# Altium project EasyPay.PrjPcb
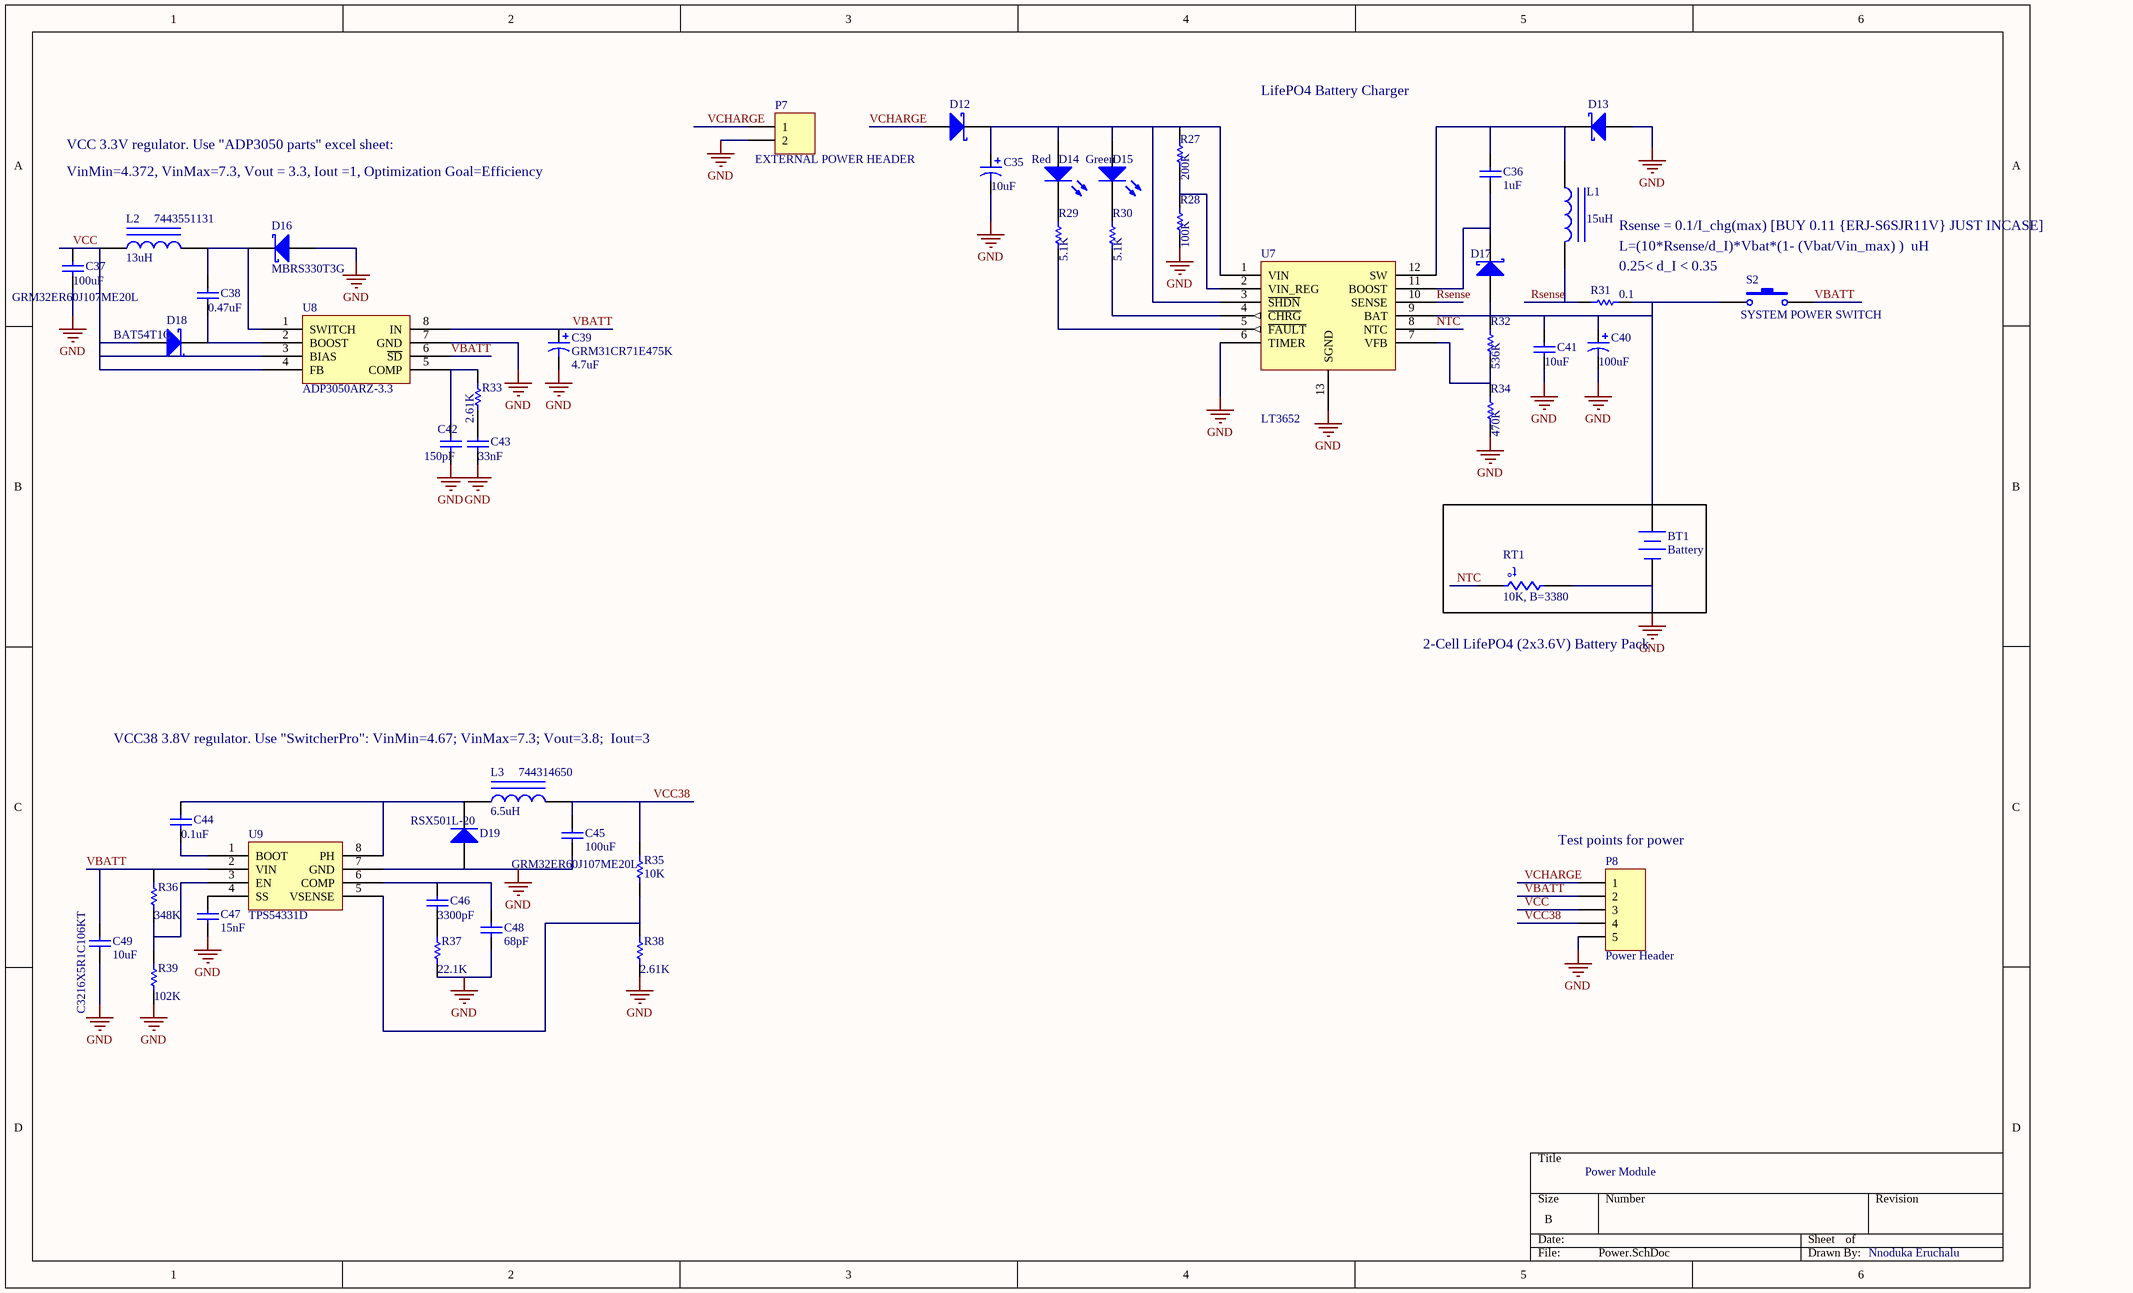
[diagram p0: Power.SchDoc]
4 sheets, 127 parts. Net scope: global (net labels, ports and power ports of the same name join across sheets).
Board file: EasyPay.PcbDoc
Sheets:
  Power.SchDoc
  Data.SchDoc
  MCU.SchDoc
  Peripherals.SchDoc

## Sheet Power.SchDoc
size B

### Parts
BT1  Battery  [JST PH]
C35  value 10uF  [TC7343-2917]  (hidden comment: TR3D106K035C0125)
C36  value 1uF  [2012[0805]]  (hidden comment: C2012Y5V1H105Z/0.85)
C37  GRM32ER60J107ME20L  value 100uF  [3225[1210]]
C38  value 0.47uF  [2012[0805]]  (hidden comment: CGJ4J2X7R0J474K)
C39  GRM31CR71E475K  value 4.7uF  [3216[1206]]
C40  value 100uF  [TC7343-2917]  (hidden comment: T495D107K010ZTE100)
C41  value 10uF  [2012[0805]]  (hidden comment: GRM21BR71A106KE51L)
C42  value 150pF  [2012[0805]]  (hidden comment: C0805C151J5GACTU)
C43  value 33nF  [2012[0805]]  (hidden comment: C0805C333J3RACTU)
C44  value 0.1uF  [2012[0805]]  (hidden comment: C2012X7R1H104K/0.85)
C45  GRM32ER60J107ME20L  value 100uF  [3225[1210]]
C46  value 3300pF  [2012[0805]]  (hidden comment: C2012C0G1H332J/1.25)
C47  value 15nF  [2012[0805]]  (hidden comment: C2012C0G1H153J)
C48  value 68pF  [2012[0805]]  (hidden comment: C0805C680J5GACTU)
C49  C3216X5R1C106KT  value 10uF  [3216[1206]]
D12  CDBA340L-G  [SMA DO-214AC]  (value not drawn)
D13  CDBA340L-G  [SMA DO-214AC]  (value not drawn)
D14  value Red  [LTST-C17X]  (hidden comment: LTST-C170KRKT)
D15  value Green  [LTST-C17X]  (hidden comment: LTST-C171GKT)
D16  MBRS330T3G  [SMC DO-214AB]
D17  CDBA340L-G  [SMA DO-214AC]  (value not drawn)
D18  BAT54T1G  [SOD123]
D19  RSX501L-20  [RSX501L-20]
L1  value 15uH  [SLF7055]  (hidden comment: SLF7055T-150M2R1-3PF)
L2  7443551131  value 13uH  [7443551131]
L3  744314650  value 6.5uH  [744314650]
P7  EXTERNAL POWER HEADER  [JST PH]
P8  Power Header  [HDR1X5]
R27  value 200K  [2012[0805]]  (hidden comment: ERJ-6GEYJ204V)
R28  value 100K  [2012[0805]]  (hidden comment: ERJ-6GEYJ104V)
R29  value 5.1K  [2012[0805]]  (hidden comment: ERJ-6GEYJ512V)
R30  value 5.1K  [2012[0805]]  (hidden comment: ERJ-6GEYJ512V)
R31  value 0.1  [2012[0805]]  (hidden comment: ERJ-L06KF10CV)
R32  value 536K  [2012[0805]]  (hidden comment: ERJ-6ENF5363V)
R33  value 2.61K  [2012[0805]]  (hidden comment: ERJ-6ENF2611V)
R34  value 470K  [2012[0805]]  (hidden comment: ERJ-6GEYJ474V)
R35  value 10K  [2012[0805]]  (hidden comment: ERJ-6ENF1002V)
R36  value 348K  [2012[0805]]  (hidden comment: ERJ-6ENF3483V)
R37  value 22.1K  [2012[0805]]  (hidden comment: ERJ-6ENF2212V)
R38  value 2.61K  [2012[0805]]  (hidden comment: ERJ-6ENF2611V)
R39  value 102K  [2012[0805]]  (hidden comment: ERJ-6ENF1023V)
RT1  value 10K, B=3380  [1608[0603]]  (hidden comment: NCP18XH103F03RB)
S2  SYSTEM POWER SWITCH  [JST PH]
U7  LT3652  [LT3652MSE]
U8  ADP3050ARZ-3.3  [SOIC127P600-8N]
U9  TPS54331D  [SOIC127P600-8N]

### Nets
GND: BT1.2(-) C35.2 C37.1 C39.2 C40.2 C41.1 C42.1 C43.1 C45.1 C47.1 C48.1 C49.1 D13.1(A) D16.1(A) D19.1(A) P7.2 P8.5 R28.2 R34.2 R37.2 R38.2 R39.2 RT1.2 U7.6(TIMER) U7.13(SGND) U8.7(GND) U9.7(GND)
VCC: C37.2 D18.1(A) L2.1 P8.3 U8.3(BIAS) U8.4(FB)
VCC38: C45.2 L3.2 P8.4 R35.1
NTC: RT1.1 U7.8(NTC)
Rsense: L1.2 R31.2 U7.10(SENSE)
VBATT: C39.1 C49.2 P8.2 R36.1 S2.2 U8.6(~{SD}) U8.8(IN) U9.2(VIN)
VCHARGE: D12.1(A) P7.1 P8.1
NetBT1_1: BT1.1(+) C40.1 C41.2 D17.1(A) R31.1 R32.1 S2.1 U7.9(BAT)
NetC35_1: C35.1 D12.2(K) D14.1(A) D15.1(A) R27.1 U7.1(VIN) U7.3(~{SHDN})
NetC36_1: C36.1 D17.2(K) U7.11(BOOST)
NetC36_2: C36.2 D13.2(K) L1.1 U7.12(SW)
NetC38_1: C38.1 D18.2(K) U8.2(BOOST)
NetC38_2: C38.2 D16.2(K) L2.2 U8.1(SWITCH)
NetC42_2: C42.2 R33.1 U8.5(COMP)
NetC43_2: C43.2 R33.2
NetC44_1: C44.1 U9.1(BOOT)
NetC44_2: C44.2 D19.2(K) L3.1 U9.8(PH)
NetC46_1: C46.1 R37.1
NetC46_2: C46.2 C48.2 U9.6(COMP)
NetC47_2: C47.2 U9.4(SS)
NetD14_2: D14.2(K) R29.1
NetD15_2: D15.2(K) R30.1
NetR27_2: R27.2 R28.1 U7.2(VIN_REG)
NetR29_2: R29.2 U7.5(~{FAULT})
NetR30_2: R30.2 U7.4(~{CHRG})
NetR32_2: R32.2 R34.1 U7.7(VFB)
NetR35_2: R35.2 R38.1 U9.5(VSENSE)
NetR36_2: R36.2 R39.1 U9.3(EN)

### Notes on the sheet
- LifePO4 Battery Charger
- VCC 3.3V regulator. Use "ADP3050 parts" excel sheet:
- VinMin=4.372, VinMax=7.3, Vout = 3.3, Iout =1, Optimization Goal=Efficiency
- Rsense = 0.1/I_chg(max) [BUY 0.11 {ERJ-S6SJR11V} JUST INCASE]
- L=(10*Rsense/d_I)*Vbat*(1- (Vbat/Vin_max) )  uH
- 0.25< d_I < 0.35
- 2-Cell LifePO4 (2x3.6V) Battery Pack
- VCC38 3.8V regulator. Use "SwitcherPro": VinMin=4.67; VinMax=7.3; Vout=3.8;  Iout=3
- (near P8) Test points for power
- Power Module
- Nnoduka Eruchalu
- (in symbol Res Thermal) t°

### Library data of the parts
BT1 = Battery: Multicell Battery; Published: 24-Mar-1999; LatestRevisionDate: 17-Jul-2002; LatestRevisionNote: Re-released for DXP Platform.; PackageReference: BAT-2; Publisher: Altium Limited
C35 C39 C40 = Cap Pol1: Polarized Capacitor (Radial); Published: 8-Jun-2000; LatestRevisionDate: 17-Jul-2002; LatestRevisionNote: Re-released for DXP Platform.; PackageReference: RB7.6-15; Publisher: Altium Limited
C36-C38 C41-C49 = C0805: Ceramic Chip Capacitor - Standard; Note: Footprint corresponds to dimensions for bulk cassette packaging. This case size has tightened tolerances.; Published: 17-Jul-2002; LatestRevisionDate: 19-Mar-2004; LatestRevisionNote: Silkscreen size reduced.; DatasheetDocument: Mar-2001; PackageDocument: Mar-2001; PackageReference: 0805; Publisher: Altium Limited; Code_JEITA: 0805; Code_IPC: 2012[0805]; ComponentLink1Description: Manufacturer Link; ComponentLink1URL: http://www.kemet.com/; ComponentLink2Description: Datasheet; ComponentLink2URL: http://www.kemet.com/kemet/web/homepage/kechome.nsf/vapubfilesname/F3102TA.pdf/$file/F3102TA.pdf
D12 D13 D16 D17 = 30BQ040: Schottky Rectifier; Published: 8-Jun-2000; LatestRevisionDate: 17-Jul-2002; LatestRevisionNote: Re-released for DXP Platform.; DatasheetDocument: PD-2.439; PackageReference: SMC; Publisher: Altium Limited; Code_JEDEC: DO-214-AB; ComponentLink1Description: Manufacturer Link; ComponentLink1URL: http://www.irf.com/; ComponentLink2Description: Datasheet; ComponentLink2URL: http://www.irf.com/product-info/datasheets/data/30bq040.pdf
D14 D15 = LED2: Typical RED, GREEN, YELLOW, AMBER GaAs LED; Published: 8-Jun-2000; LatestRevisionDate: 17-Jul-2002; LatestRevisionNote: Re-released for DXP Platform.; PackageDocument: Feb-2002; PackageReference: 3.2X1.6X1.1; Publisher: Altium Limited
D18 = Diode 11DQ03: Schottky Rectifier; Published: 8-Jun-2000; LatestRevisionDate: 17-Jul-2002; LatestRevisionNote: Re-released for DXP Platform.; DatasheetDocument: Dec-1997; PackageReference: DO-204AL; Publisher: Altium Limited; Code_JEDEC: DO-204-AL; ComponentLink1Description: Manufacturer Link; ComponentLink1URL: http://www.irf.com/; ComponentLink2Description: Datasheet; ComponentLink2URL: http://www.irf.com/product-info/datasheets/data/11dq03.pdf
D19 = Diode: Default Diode; Published: 8-Jun-2000; LatestRevisionDate: 17-Jul-2002; LatestRevisionNote: Re-released for DXP Platform.; PackageDocument: Sep-1996; PackageReference: SMC; Publisher: Altium Limited; Code_JEDEC: DO-214-AB
L1-L3 = Inductor Iron: Magnetic-Core Inductor; Published: 24-Mar-1999; LatestRevisionDate: 17-Jul-2002; LatestRevisionNote: Re-released for DXP Platform.; PackageReference: AXIAL-0.9; Publisher: Altium Limited
P7 = Header 2: Header, 2-Pin; LatestRevisionDate: 17-Jul-2002; LatestRevisionNote: Re-released for DXP Platform.; Publisher: Altium Limited
P8 = Header 5: Header, 5-Pin; LatestRevisionDate: 17-Jul-2002; LatestRevisionNote: Re-released for DXP Platform.; Publisher: Altium Limited
R27-R39 = Res1: Resistor; Published: 8-Jun-2000; LatestRevisionDate: 17-Jul-2002; LatestRevisionNote: Re-released for DXP Platform.; PackageReference: AXIAL-0.3; Publisher: Altium Limited
RT1 = Res Thermal: Thermistor; Published: 24-Mar-1999; LatestRevisionDate: 04-Mar-2005; LatestRevisionNote: PCB Footprint replaced.; PackageReference: 6-0805; Publisher: Altium Limited
S2 = SW-PB: Switch; Published: 24-Mar-1999; LatestRevisionDate: 17-Jul-2002; LatestRevisionNote: Re-released for DXP Platform.; PackageReference: SPST-2; Publisher: Altium Limited

## Sheet Data.SchDoc
size B
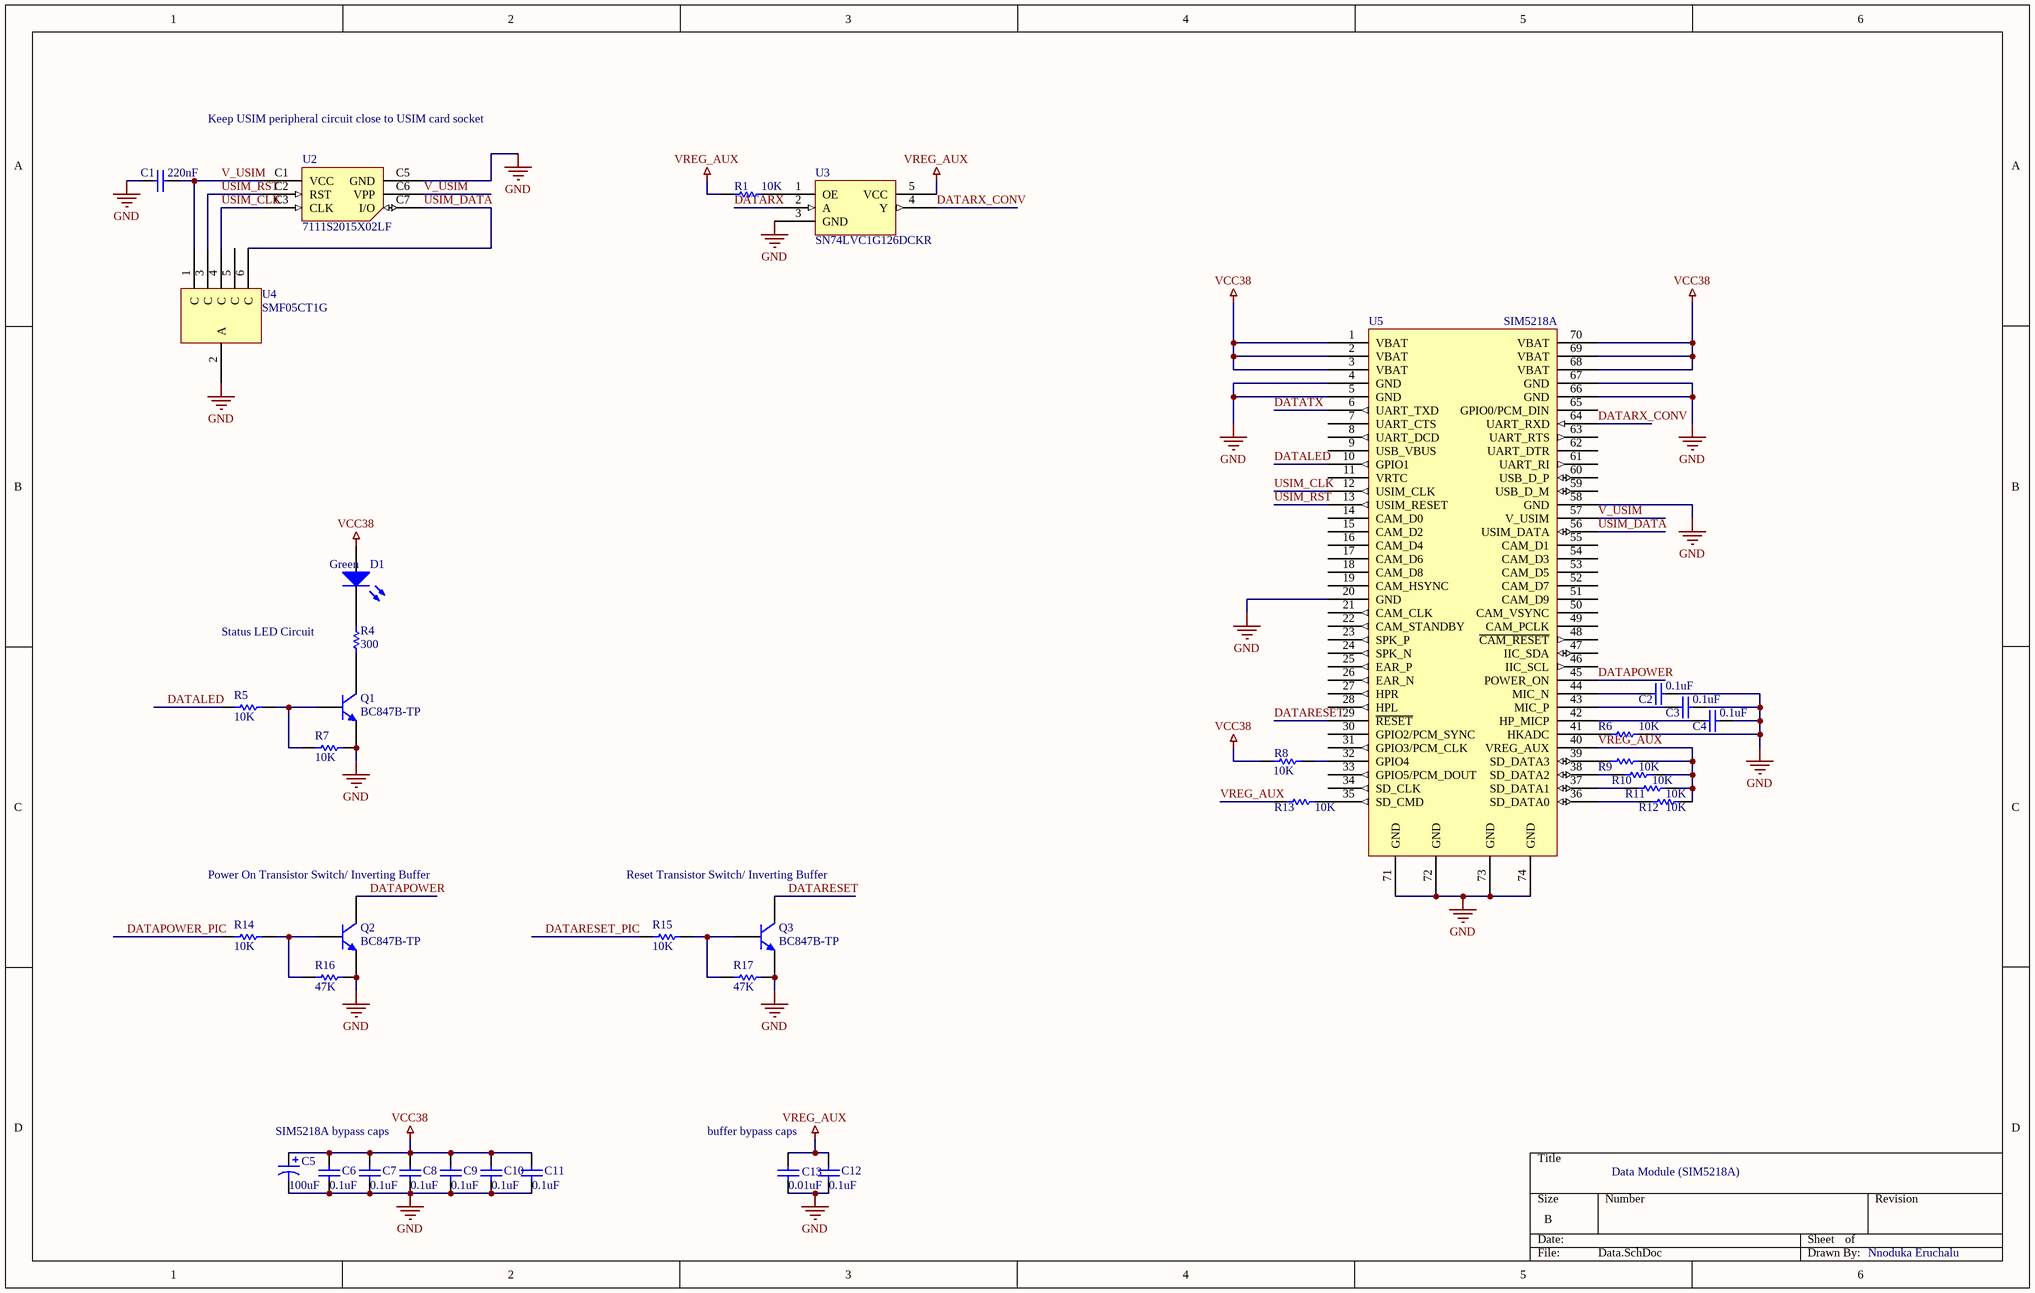
[diagram p1: Data.SchDoc]

### Parts
C1  value 220nF  [2012[0805]]  (hidden comment: C2012X7R1H224K)
C2  value 0.1uF  [2012[0805]]  (hidden comment: C2012X7R1H104K/0.85)
C3  value 0.1uF  [2012[0805]]  (hidden comment: C2012X7R1H104K/0.85)
C4  value 0.1uF  [2012[0805]]  (hidden comment: C2012X7R1H104K/0.85)
C5  value 100uF  [TC3528-1411]  (hidden comment: T520B107M004ATE070)
C6  value 0.1uF  [2012[0805]]  (hidden comment: C2012X7R1H104K/0.85)
C7  value 0.1uF  [2012[0805]]  (hidden comment: C2012X7R1H104K/0.85)
C8  value 0.1uF  [2012[0805]]  (hidden comment: C2012X7R1H104K/0.85)
C9  value 0.1uF  [2012[0805]]  (hidden comment: C2012X7R1H104K/0.85)
C10  value 0.1uF  [2012[0805]]  (hidden comment: C2012X7R1H104K/0.85)
C11  value 0.1uF  [2012[0805]]  (hidden comment: C2012X7R1H104K/0.85)
C12  value 0.1uF  [2012[0805]]  (hidden comment: C2012X7R1H104K/0.85)
C13  value 0.01uF  [2012[0805]]  (hidden comment: C2012X7R2E103K)
D1  value Green  [LTST-C17X]  (hidden comment: LTST-C171GKT)
Q1  BC847B-TP  [SOT23-3N]
Q2  BC847B-TP  [SOT23-3N]
Q3  BC847B-TP  [SOT23-3N]
R1  value 10K  [2012[0805]]  (hidden comment: ERJ-6GEYJ103V)
R4  value 300  [2012[0805]]  (hidden comment: ERJ-6GEYJ301V)
R5  value 10K  [2012[0805]]  (hidden comment: ERJ-6GEYJ103V)
R6  value 10K  [2012[0805]]  (hidden comment: ERJ-6GEYJ103V)
R7  value 10K  [2012[0805]]  (hidden comment: ERJ-6GEYJ103V)
R8  value 10K  [2012[0805]]  (hidden comment: ERJ-6GEYJ103V)
R9  value 10K  [2012[0805]]  (hidden comment: ERJ-6GEYJ103V)
R10  value 10K  [2012[0805]]  (hidden comment: ERJ-6GEYJ103V)
R11  value 10K  [2012[0805]]  (hidden comment: ERJ-6GEYJ103V)
R12  value 10K  [2012[0805]]  (hidden comment: ERJ-6GEYJ103V)
R13  value 10K  [2012[0805]]  (hidden comment: ERJ-6GEYJ103V)
R14  value 10K  [2012[0805]]  (hidden comment: ERJ-6GEYJ103V)
R15  value 10K  [2012[0805]]  (hidden comment: ERJ-6GEYJ103V)
R16  value 47K  [2012[0805]]  (hidden comment: ERJ-6GEYJ473V)
R17  value 47K  [2012[0805]]  (hidden comment: ERJ-6GEYJ473V)
U2  7111S2015X02LF  [7111S2015X02LF]
U3  SN74LVC1G126DCKR  [SOT353-5N]
U4  SMF05CT1G  [SOT363-6N]
U5  SIM5218A  [SIM5218A v2]

### Nets
GND: C1.1 C2.2 C3.2 C4.2 C5.2 C6.1 C7.1 C8.1 C9.1 C10.1 C11.1 C12.1 C13.1 Q1.2(E) Q2.2(E) Q3.2(E) R6.2 R7.1 R16.1 R17.1 U2.C5(GND) U3.3(GND) U4.2(A) U5.4(GND) U5.5(GND) U5.20(GND) U5.58(GND) U5.66(GND) U5.67(GND) U5.71(GND) U5.72(GND) U5.73(GND) U5.74(GND)
VCC38: C5.1 C6.2 C7.2 C8.2 C9.2 C10.2 C11.2 D1.1(A) R8.1 U5.1(VBAT) U5.2(VBAT) U5.3(VBAT) U5.68(VBAT) U5.69(VBAT) U5.70(VBAT)
VREG_AUX: C12.2 C13.2 R1.2 R9.2 R10.2 R11.2 R12.2 R13.1 U3.5(VCC) U5.40(VREG_AUX)
DATALED: R5.2 U5.10(GPIO1)
DATAPOWER: Q2.3(C) U5.45(POWER_ON)
DATAPOWER_PIC: R14.2
DATARESET: Q3.3(C) U5.29(~{RESET})
DATARESET_PIC: R15.2
DATARX: U3.2(A)
DATARX_CONV: U3.4(Y) U5.64(UART_RXD)
DATATX: U5.6(UART_TXD)
USIM_CLK: U2.C3(CLK) U4.4(C) U5.12(USIM_CLK)
USIM_DATA: U2.C7(I/O) U4.6(C) U5.56(USIM_DATA)
USIM_RST: U2.C2(RST) U4.3(C) U5.13(USIM_RESET)
V_USIM: C1.2 U2.C1(VCC) U2.C6(VPP) U4.1(C) U5.57(V_USIM)
NetC2_1: C2.1 U5.44(MIC_N)
NetC3_1: C3.1 U5.43(MIC_P)
NetC4_1: C4.1 U5.42(HP_MICP)
NetD1_2: D1.2(K) R4.1
NetQ1_1: Q1.1(B) R5.1 R7.2
NetQ1_3: Q1.3(C) R4.2
NetQ2_1: Q2.1(B) R14.1 R16.2
NetQ3_1: Q3.1(B) R15.1 R17.2
NetR1_1: R1.1 U3.1(OE)
NetR6_1: R6.1 U5.41(HKADC)
NetR8_2: R8.2 U5.32(GPIO4)
NetR9_1: R9.1 U5.39(SD_DATA3)
NetR10_1: R10.1 U5.38(SD_DATA2)
NetR11_1: R11.1 U5.37(SD_DATA1)
NetR12_1: R12.1 U5.36(SD_DATA0)
NetR13_2: R13.2 U5.35(SD_CMD)

Not connected (* = marked no-connect by the designer): U4 5(C); U5 7(UART_CTS) 8(UART_DCD) 9(USB_VBUS) 11(VRTC) 14(CAM_D0) 15(CAM_D2) 16(CAM_D4) 17(CAM_D6) 18(CAM_D8) 19(CAM_HSYNC) 21(CAM_CLK) 22(CAM_STANDBY) 23(SPK_P) 24(SPK_N) 25(EAR_P) 26(EAR_N) 27(HPR) 28(HPL) 30(GPIO2/PCM_SYNC) 31(GPIO3/PCM_CLK) 33(GPIO5/PCM_DOUT) 34(SD_CLK) 46(IIC_SCL) 47(IIC_SDA) 48(~{CAM_RESET}) 49(CAM_PCLK) 50(CAM_VSYNC) 51(CAM_D9) 52(CAM_D7) 53(CAM_D5) 54(CAM_D3) 55(CAM_D1) 59(USB_D_M) 60(USB_D_P) 61(UART_RI) 62(UART_DTR) 63(UART_RTS) 65(GPIO0/PCM_DIN)

### Notes on the sheet
- Keep USIM peripheral circuit close to USIM card socket
- (near R4) Status LED Circuit
- Power On Transistor Switch/ Inverting Buffer
- Reset Transistor Switch/ Inverting Buffer
- SIM5218A bypass caps
- buffer bypass caps
- Data Module (SIM5218A)
- Nnoduka Eruchalu

### Library data of the parts
C1-C4 C6-C13 = C0805: as C36 on sheet Power; Published: 17-Jul-2002; LatestRevisionDate: 19-Mar-2004; LatestRevisionNote: Silkscreen size reduced.; DatasheetDocument: Mar-2001; PackageDocument: Mar-2001; PackageReference: 0805; Publisher: Altium Limited; Code_JEITA: 0805; Code_IPC: 2012[0805]; ComponentLink1Description: Manufacturer Link; ComponentLink1URL: http://www.kemet.com/; ComponentLink2Description: Datasheet; ComponentLink2URL: http://www.kemet.com/kemet/web/homepage/kechome.nsf/vapubfilesname/F3102TA.pdf/$file/F3102TA.pdf
C5 = Cap Pol1: Polarized Capacitor (Radial); Published: 8-Jun-2000; LatestRevisionDate: 17-Jul-2002; LatestRevisionNote: Re-released for DXP Platform.; PackageReference: RB7.6-15; Publisher: Altium Limited
D1 = LED2: as D14 on sheet Power; Published: 8-Jun-2000; LatestRevisionDate: 17-Jul-2002; LatestRevisionNote: Re-released for DXP Platform.; PackageDocument: Feb-2002; PackageReference: 3.2X1.6X1.1; Publisher: Altium Limited
Q1-Q3 = NPN: NPN Bipolar Transistor; Published: 8-Jun-2000; LatestRevisionDate: 17-Jul-2002; LatestRevisionNote: Re-released for DXP Platform.; PackageReference: TO-226; Publisher: Altium Limited; Code_JEDEC: TO-226-AA
R1 R4-R17 = Res1: Resistor; Published: 8-Jun-2000; LatestRevisionDate: 17-Jul-2002; LatestRevisionNote: Re-released for DXP Platform.; PackageReference: AXIAL-0.3; Publisher: Altium Limited
U3 = SN74LVC1G126
U4 = SMF05C

## Sheet MCU.SchDoc
size B
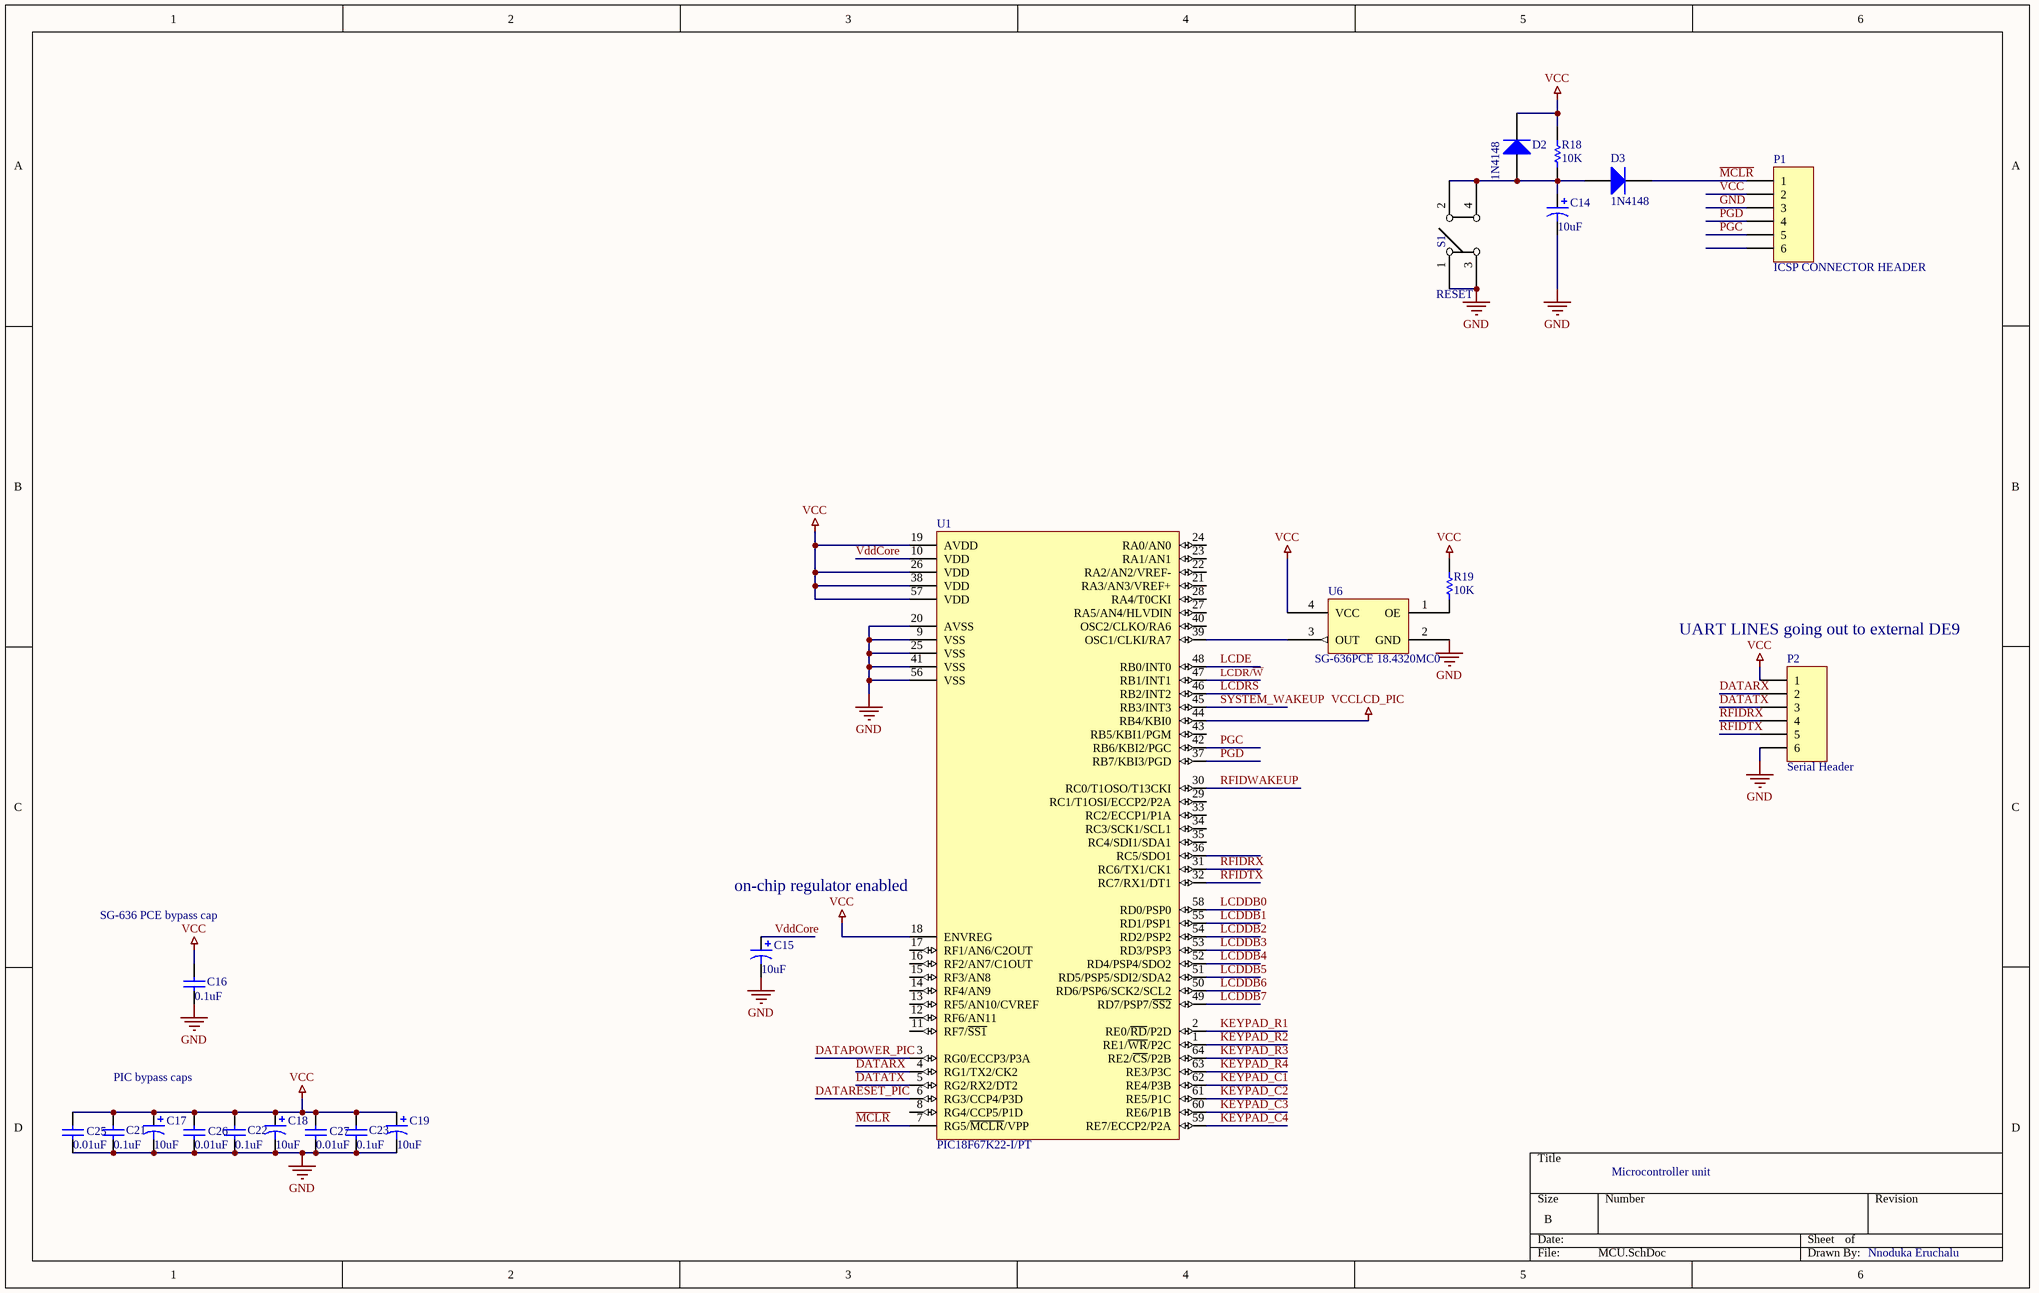
[diagram p2: MCU.SchDoc]

### Parts
C14  value 10uF  [3216[1206]]  (hidden comment: T520A106M010ATE080)
C15  value 10uF  [3216[1206]]  (hidden comment: T520A106M010ATE080)
C16  value 0.1uF  [2012[0805]]  (hidden comment: C2012X7R1H104K/0.85)
C17  value 10uF  [3216[1206]]  (hidden comment: T520A106M010ATE080)
C18  value 10uF  [3216[1206]]  (hidden comment: T520A106M010ATE080)
C19  value 10uF  [3216[1206]]  (hidden comment: T520A106M010ATE080)
C21  value 0.1uF  [2012[0805]]  (hidden comment: C2012X7R1H104K/0.85)
C22  value 0.1uF  [2012[0805]]  (hidden comment: C2012X7R1H104K/0.85)
C23  value 0.1uF  [2012[0805]]  (hidden comment: C2012X7R1H104K/0.85)
C25  value 0.01uF  [2012[0805]]  (hidden comment: C2012X7R2E103K)
C26  value 0.01uF  [2012[0805]]  (hidden comment: C2012X7R2E103K)
C27  value 0.01uF  [2012[0805]]  (hidden comment: C2012X7R2E103K)
D2  1N4148  [SOD123]
D3  1N4148  [SOD123]
P1  ICSP CONNECTOR HEADER  [HDR1X6]
P2  Serial Header  [HDR1X6]
R18  value 10K  [2012[0805]]  (hidden comment: ERJ-6GEYJ103V)
R19  value 10K  [2012[0805]]  (hidden comment: ERJ-6GEYJ103V)
S1  value RESET  [D6C]  (hidden comment: D6C00 F2 LFS)
U1  PIC18F67K22-I/PT  [TQFP-PT64_N]
U6  SG-636PCE 18.4320MC0  [SG-636PCE]

### Nets
GND: C14.2 C15.2 C16.1 C17.2 C18.2 C19.2 C21.1 C22.1 C23.1 C25.1 C26.1 C27.1 P1.3 P2.6 S1.1 S1.3 U1.9(VSS) U1.20(AVSS) U1.25(VSS) U1.41(VSS) U1.56(VSS) U6.2(GND)
VCC: C16.2 C17.1 C18.1 C19.1 C21.2 C22.2 C23.2 C25.2 C26.2 C27.2 D2.2(K) P1.2 P2.1 R18.1 R19.1 U1.18(ENVREG) U1.19(AVDD) U1.26(VDD) U1.38(VDD) U1.57(VDD) U6.4(VCC)
VCCLCD_PIC: U1.44(RB4/KBI0)
DATAPOWER_PIC: U1.3(RG0/ECCP3/P3A)
DATARESET_PIC: U1.6(RG3/CCP4/P3D)
DATARX: P2.2 U1.4(RG1/TX2/CK2)
DATATX: P2.3 U1.5(RG2/RX2/DT2)
KEYPAD_C1: U1.62(RE4/P3B)
KEYPAD_C2: U1.61(RE5/P1C)
KEYPAD_C3: U1.60(RE6/P1B)
KEYPAD_C4: U1.59(RE7/ECCP2/P2A)
KEYPAD_R1: U1.2(RE0/~{RD}/P2D)
KEYPAD_R2: U1.1(RE1/~{WR}/P2C)
KEYPAD_R3: U1.64(RE2/~{CS}/P2B)
KEYPAD_R4: U1.63(RE3/P3C)
LCDDB0: U1.58(RD0/PSP0)
LCDDB1: U1.55(RD1/PSP1)
LCDDB2: U1.54(RD2/PSP2)
LCDDB3: U1.53(RD3/PSP3)
LCDDB4: U1.52(RD4/PSP4/SDO2)
LCDDB5: U1.51(RD5/PSP5/SDI2/SDA2)
LCDDB6: U1.50(RD6/PSP6/SCK2/SCL2)
LCDDB7: U1.49(RD7/PSP7/~{SS2})
LCDE: U1.48(RB0/INT0)
LCDR/~{W}: U1.47(RB1/INT1)
LCDRS: U1.46(RB2/INT2)
~{MCLR}: D3.2(K) P1.1 U1.7(RG5/~{MCLR}/VPP)
PGC: P1.5 U1.42(RB6/KBI2/PGC)
PGD: P1.4 U1.37(RB7/KBI3/PGD)
RFIDRX: P2.4 U1.31(RC6/TX1/CK1)
RFIDTX: P2.5 U1.32(RC7/RX1/DT1)
RFIDWAKEUP: U1.30(RC0/T1OSO/T13CKI)
SYSTEM_WAKEUP: U1.45(RB3/INT3)
VddCore: C15.1 U1.10(VDD)
NetC14_1: C14.1 D2.1(A) D3.1(A) R18.2 S1.2 S1.4
NetR19_2: R19.2 U6.1(OE)
NetU1_39: U1.39(OSC1/CLKI/RA7) U6.3(OUT)

Not connected (* = marked no-connect by the designer): P1 6; U1 8(RG4/CCP5/P1D) 11(RF7/~{SS1}) 12(RF6/AN11) 13(RF5/AN10/CVREF) 14(RF4/AN9) 15(RF3/AN8) 16(RF2/AN7/C1OUT) 17(RF1/AN6/C2OUT) 21(RA3/AN3/VREF+) 22(RA2/AN2/VREF-) 23(RA1/AN1) 24(RA0/AN0) 27(RA5/AN4/HLVDIN) 28(RA4/T0CKI) 29(RC1/T1OSI/ECCP2/P2A) 33(RC2/ECCP1/P1A) 34(RC3/SCK1/SCL1) 35(RC4/SDI1/SDA1) 36(RC5/SDO1) 40(OSC2/CLKO/RA6) 43(RB5/KBI1/PGM)

### Notes on the sheet
- (near P2) UART LINES going out to external DE9
- (near U1) on-chip regulator enabled
- SG-636 PCE bypass cap
- PIC bypass caps
- Microcontroller unit
- Nnoduka Eruchalu

### Library data of the parts
C14 C15 C17-C19 = Cap Pol1: Polarized Capacitor (Radial); Published: 8-Jun-2000; LatestRevisionDate: 17-Jul-2002; LatestRevisionNote: Re-released for DXP Platform.; PackageReference: RB7.6-15; Publisher: Altium Limited
C16 C21-C23 C25-C27 = C0805: as C36 on sheet Power; Published: 17-Jul-2002; LatestRevisionDate: 19-Mar-2004; LatestRevisionNote: Silkscreen size reduced.; DatasheetDocument: Mar-2001; PackageDocument: Mar-2001; PackageReference: 0805; Publisher: Altium Limited; Code_JEITA: 0805; Code_IPC: 2012[0805]; ComponentLink1Description: Manufacturer Link; ComponentLink1URL: http://www.kemet.com/; ComponentLink2Description: Datasheet; ComponentLink2URL: http://www.kemet.com/kemet/web/homepage/kechome.nsf/vapubfilesname/F3102TA.pdf/$file/F3102TA.pdf
D2 D3 = Diode 1N4148: High Conductance Fast Diode; Published: 8-Jun-2000; LatestRevisionDate: 17-Jul-2002; LatestRevisionNote: Re-released for DXP Platform.; DatasheetDocument: 1997; PackageReference: DO-35; Publisher: Altium Limited; Code_JEDEC: DO-204-AH; ComponentLink1Description: Manufacturer Link; ComponentLink1URL: http://www.fairchildsemi.com/; ComponentLink2Description: Datasheet; ComponentLink2URL: http://www.fairchildsemi.com/ds/1N%2F1N4148.pdf
P1 P2 = Header 6: Header, 6-Pin; LatestRevisionDate: 17-Jul-2002; LatestRevisionNote: Re-released for DXP Platform.; Publisher: Altium Limited
R18 R19 = Res1: Resistor; Published: 8-Jun-2000; LatestRevisionDate: 17-Jul-2002; LatestRevisionNote: Re-released for DXP Platform.; PackageReference: AXIAL-0.3; Publisher: Altium Limited
S1 = D6C
U1 = PIC18F6722-I/PT: 1-Mbit, Enhanced Flash Microcontroller with 10-Bit A/D and nanoWatt Technology, 128K Flash, 64-Pin TQFP, Industrial Temperature Range; Published: 29-Jan-2009; DatasheetVersion: revC, Oct-2008; PackageVersion: revBB, Aug-2009; PackageReference: TQFP-PT64; Publisher: Altium Limited; PackageDescription: 64-Lead Thin Plastic Quad Flat Pack (PT) - 10x10x1mm Body, 2.00mm [TQFP]; Supplier 1: Digi-Key; Supplier Part Number 1: PIC18F6722-I/PT-ND; Supplier 2: Farnell; Supplier Part Number 2: 8752966; Supplier 3: Farnell; Supplier Part Number 3: 1528416; Code_JEDEC: MS-026; ComponentLink1Description: Datasheet; ComponentLink1URL: http://ww1.microchip.com/downloads/en/DeviceDoc/39646c.pdf; ComponentLink2Description: Packaging Specification; ComponentLink2URL: http://www.microchip.com/stellent/groups/techpub_sg/documents/packagingspec/en012702.pdf; ComponentLink3Description: Microchip.com Home; ComponentLink3URL: http://www.microchip.com/
U6 = SG636PCE

## Sheet Peripherals.SchDoc
size A
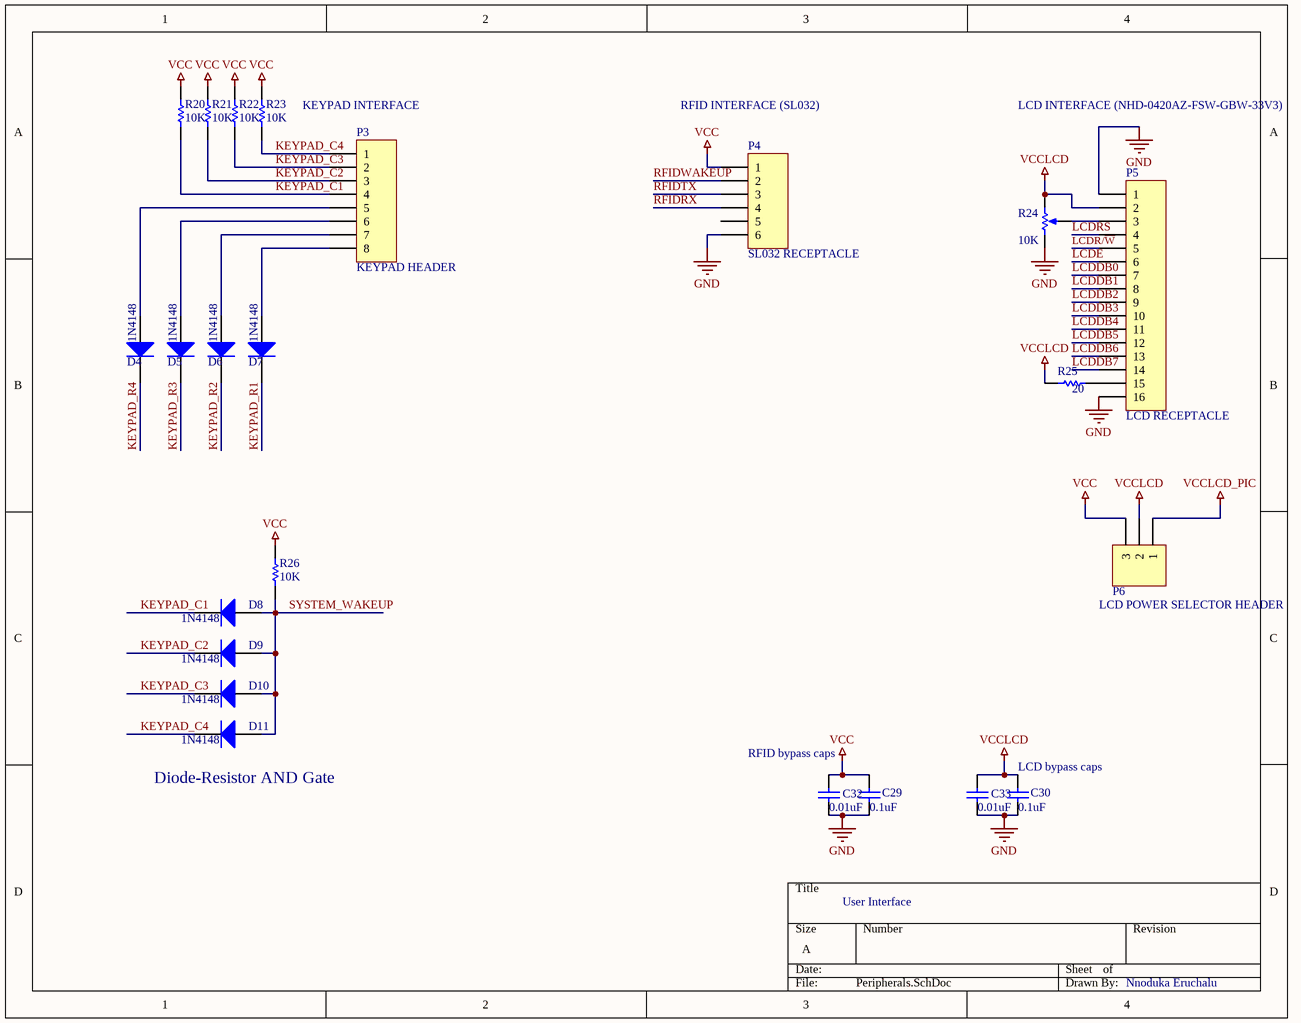
[diagram p3: Peripherals.SchDoc]

### Parts
C29  value 0.1uF  [2012[0805]]  (hidden comment: C2012X7R1H104K/0.85)
C30  value 0.1uF  [2012[0805]]  (hidden comment: C2012X7R1H104K/0.85)
C32  value 0.01uF  [2012[0805]]  (hidden comment: C2012X7R2E103K)
C33  value 0.01uF  [2012[0805]]  (hidden comment: C2012X7R2E103K)
D4  1N4148  [SOD123]
D5  1N4148  [SOD123]
D6  1N4148  [SOD123]
D7  1N4148  [SOD123]
D8  1N4148  [SOD123]
D9  1N4148  [SOD123]
D10  1N4148  [SOD123]
D11  1N4148  [SOD123]
P3  KEYPAD HEADER  [HDR1X8]
P4  SL032 RECEPTACLE  [HDR1X6]
P5  LCD RECEPTACLE  [HDR1X16]
P6  LCD POWER SELECTOR HEADER  [HDR1X3]
R20  value 10K  [2012[0805]]  (hidden comment: ERJ-6GEYJ103V)
R21  value 10K  [2012[0805]]  (hidden comment: ERJ-6GEYJ103V)
R22  value 10K  [2012[0805]]  (hidden comment: ERJ-6GEYJ103V)
R23  value 10K  [2012[0805]]  (hidden comment: ERJ-6GEYJ103V)
R24  value 10K  [TC33]  (hidden comment: TC33X-2-103E)
R25  value 20  [2012[0805]]  (hidden comment: ERJ-6GEYJ200V)
R26  value 10K  [2012[0805]]  (hidden comment: ERJ-6GEYJ103V)

### Nets
GND: C29.1 C30.1 C32.1 C33.1 P4.6 P5.1 P5.16 R24.1(TOP)
VCC: C29.2 C32.2 P4.1 P6.3 R20.1 R21.1 R22.1 R23.1 R26.1
VCCLCD: C30.2 C33.2 P5.2 P6.2 R24.2(BOT) R25.1
VCCLCD_PIC: P6.1
KEYPAD_C1: D8.2(K) P3.4 R20.2
KEYPAD_C2: D9.2(K) P3.3 R21.2
KEYPAD_C3: D10.2(K) P3.2 R22.2
KEYPAD_C4: D11.2(K) P3.1 R23.2
KEYPAD_R1: D7.2(K)
KEYPAD_R2: D6.2(K)
KEYPAD_R3: D5.2(K)
KEYPAD_R4: D4.2(K)
LCDDB0: P5.7
LCDDB1: P5.8
LCDDB2: P5.9
LCDDB3: P5.10
LCDDB4: P5.11
LCDDB5: P5.12
LCDDB6: P5.13
LCDDB7: P5.14
LCDE: P5.6
LCDR/~{W}: P5.5
LCDRS: P5.4
RFIDRX: P4.4
RFIDTX: P4.3
RFIDWAKEUP: P4.2
SYSTEM_WAKEUP: D8.1(A) D9.1(A) D10.1(A) D11.1(A) R26.2
NetD4_1: D4.1(A) P3.5
NetD5_1: D5.1(A) P3.6
NetD6_1: D6.1(A) P3.7
NetD7_1: D7.1(A) P3.8
NetP5_3: P5.3 R24.3(TAP)
NetP5_15: P5.15 R25.2

Not connected (* = marked no-connect by the designer): P4 5

### Notes on the sheet
- KEYPAD INTERFACE
- RFID INTERFACE (SL032)
- LCD INTERFACE (NHD-0420AZ-FSW-GBW-33V3)
- RFID bypass caps
- (near C30) LCD bypass caps
- (near D11) Diode-Resistor AND Gate
- User Interface
- Nnoduka Eruchalu

### Library data of the parts
C29 C30 C32 C33 = C0805: as C36 on sheet Power; Published: 17-Jul-2002; LatestRevisionDate: 19-Mar-2004; LatestRevisionNote: Silkscreen size reduced.; DatasheetDocument: Mar-2001; PackageDocument: Mar-2001; PackageReference: 0805; Publisher: Altium Limited; Code_JEITA: 0805; Code_IPC: 2012[0805]; ComponentLink1Description: Manufacturer Link; ComponentLink1URL: http://www.kemet.com/; ComponentLink2Description: Datasheet; ComponentLink2URL: http://www.kemet.com/kemet/web/homepage/kechome.nsf/vapubfilesname/F3102TA.pdf/$file/F3102TA.pdf
D4-D11 = Diode 1N4148: High Conductance Fast Diode; Published: 8-Jun-2000; LatestRevisionDate: 17-Jul-2002; LatestRevisionNote: Re-released for DXP Platform.; DatasheetDocument: 1997; PackageReference: DO-35; Publisher: Altium Limited; Code_JEDEC: DO-204-AH; ComponentLink1Description: Manufacturer Link; ComponentLink1URL: http://www.fairchildsemi.com/; ComponentLink2Description: Datasheet; ComponentLink2URL: http://www.fairchildsemi.com/ds/1N%2F1N4148.pdf
P3 = Header 8: Header, 8-Pin; LatestRevisionDate: 17-Jul-2002; LatestRevisionNote: Re-released for DXP Platform.; Publisher: Altium Limited
P4 = Header 6: Header, 6-Pin; LatestRevisionDate: 17-Jul-2002; LatestRevisionNote: Re-released for DXP Platform.; Publisher: Altium Limited
P5 = Header 16: Header, 16-Pin; LatestRevisionDate: 17-Jul-2002; LatestRevisionNote: Re-released for DXP Platform.; Publisher: Altium Limited
P6 = Header 3: Header, 3-Pin; LatestRevisionDate: 17-Jul-2002; LatestRevisionNote: Re-released for DXP Platform.; Publisher: Altium Limited
R20-R23 R25 R26 = Res1: Resistor; Published: 8-Jun-2000; LatestRevisionDate: 17-Jul-2002; LatestRevisionNote: Re-released for DXP Platform.; PackageReference: AXIAL-0.3; Publisher: Altium Limited
R24 = RPot: Potentiometer; Sim Note: Enter the Resistance value and the set point into parameter fields.; Set Position: 0.5; Published: 8-Jun-2000; LatestRevisionDate: 17-Jul-2002; LatestRevisionNote: Re-released for DXP Platform.; PackageReference: VR5; Publisher: Altium Limited

## Nets that join several sheets
GND: Power (27 pins), Data (33 pins), MCU (22 pins), Peripherals (8 pins)
VCC: Power (6 pins), MCU (21 pins), Peripherals (9 pins)
VCC38: Power (C45.2 L3.2 P8.4 R35.1), Data (15 pins)
VCCLCD_PIC: MCU (U1.44), Peripherals (P6.1)
DATAPOWER_PIC: Data (R14.2), MCU (U1.3)
DATARESET_PIC: Data (R15.2), MCU (U1.6)
DATARX: Data (U3.2), MCU (P2.2 U1.4)
DATATX: Data (U5.6), MCU (P2.3 U1.5)
KEYPAD_C1: MCU (U1.62), Peripherals (D8.2 P3.4 R20.2)
KEYPAD_C2: MCU (U1.61), Peripherals (D9.2 P3.3 R21.2)
KEYPAD_C3: MCU (U1.60), Peripherals (D10.2 P3.2 R22.2)
KEYPAD_C4: MCU (U1.59), Peripherals (D11.2 P3.1 R23.2)
KEYPAD_R1: MCU (U1.2), Peripherals (D7.2)
KEYPAD_R2: MCU (U1.1), Peripherals (D6.2)
KEYPAD_R3: MCU (U1.64), Peripherals (D5.2)
KEYPAD_R4: MCU (U1.63), Peripherals (D4.2)
LCDDB0: MCU (U1.58), Peripherals (P5.7)
LCDDB1: MCU (U1.55), Peripherals (P5.8)
LCDDB2: MCU (U1.54), Peripherals (P5.9)
LCDDB3: MCU (U1.53), Peripherals (P5.10)
LCDDB4: MCU (U1.52), Peripherals (P5.11)
LCDDB5: MCU (U1.51), Peripherals (P5.12)
LCDDB6: MCU (U1.50), Peripherals (P5.13)
LCDDB7: MCU (U1.49), Peripherals (P5.14)
LCDE: MCU (U1.48), Peripherals (P5.6)
LCDR/~{W}: MCU (U1.47), Peripherals (P5.5)
LCDRS: MCU (U1.46), Peripherals (P5.4)
RFIDRX: MCU (P2.4 U1.31), Peripherals (P4.4)
RFIDTX: MCU (P2.5 U1.32), Peripherals (P4.3)
RFIDWAKEUP: MCU (U1.30), Peripherals (P4.2)
SYSTEM_WAKEUP: MCU (U1.45), Peripherals (5 pins)